# Altium schematic sheet LED_Readout.SchDoc
size C
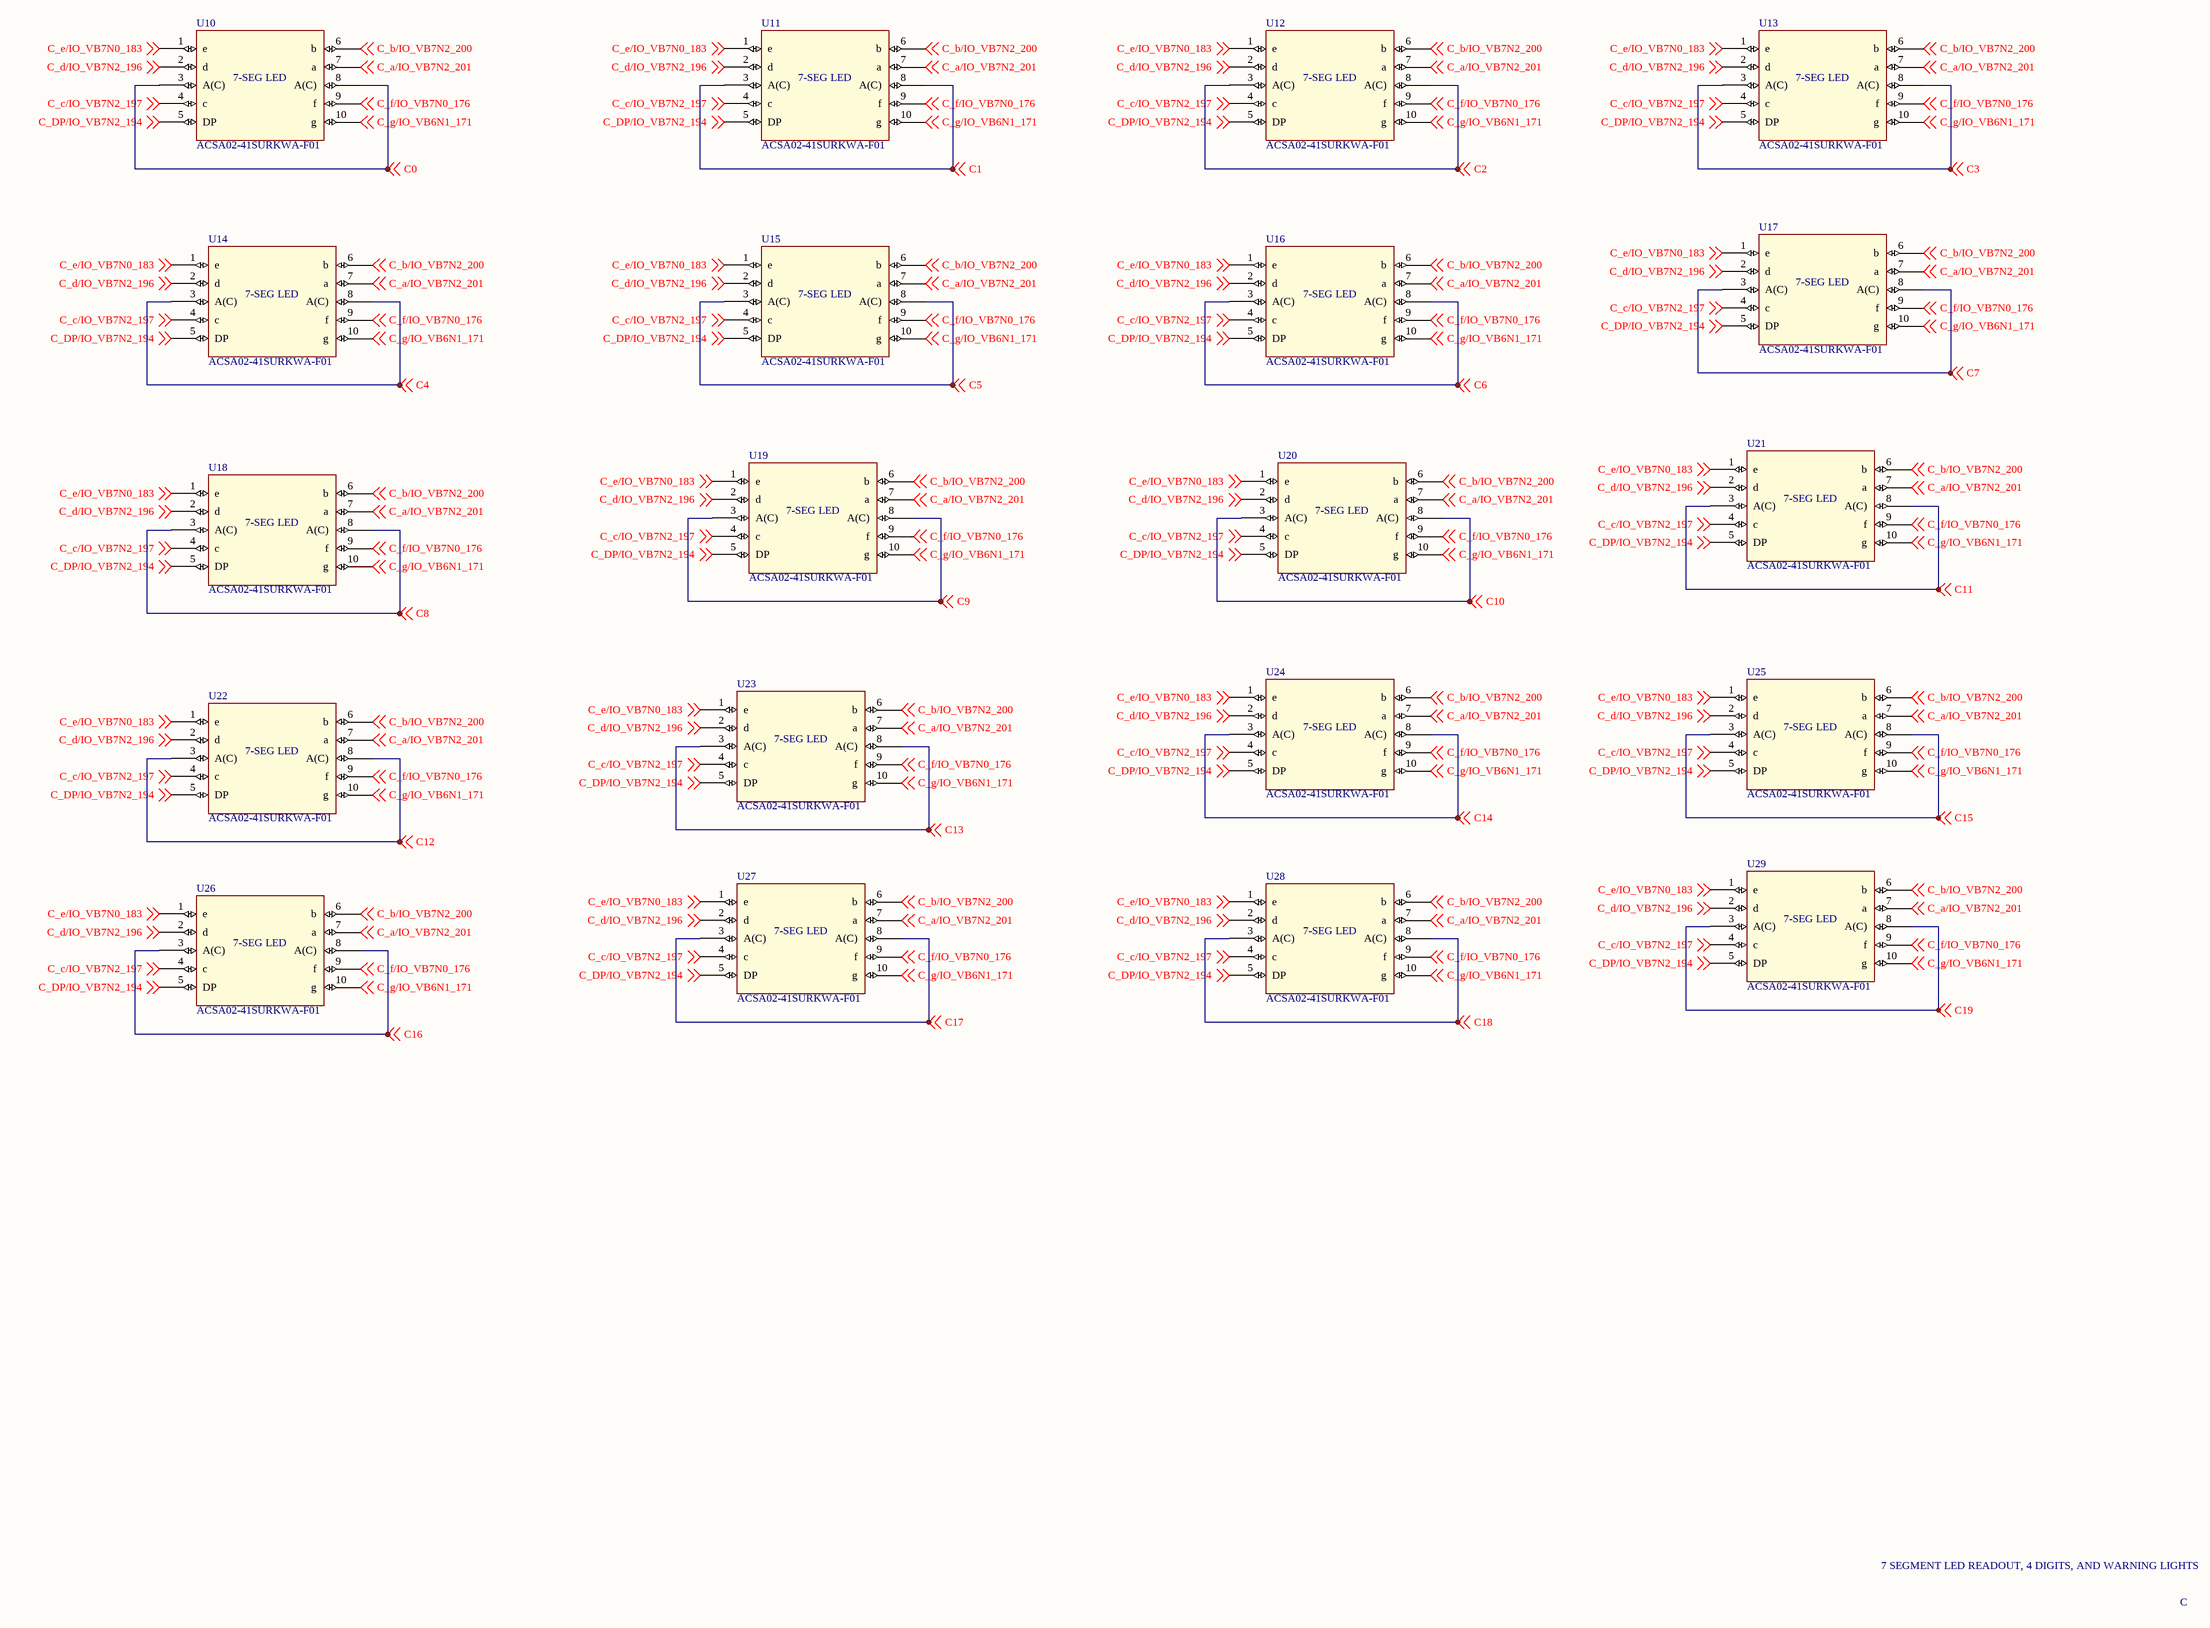
[diagram p0: LED_Readout.SchDoc]

## Parts
U10  ACSA02-41SURKWA-F01  [ACSA02-41SURKWA-F01]
U11  ACSA02-41SURKWA-F01  [ACSA02-41SURKWA-F01]
U12  ACSA02-41SURKWA-F01  [ACSA02-41SURKWA-F01]
U13  ACSA02-41SURKWA-F01  [ACSA02-41SURKWA-F01]
U14  ACSA02-41SURKWA-F01  [ACSA02-41SURKWA-F01]
U15  ACSA02-41SURKWA-F01  [ACSA02-41SURKWA-F01]
U16  ACSA02-41SURKWA-F01  [ACSA02-41SURKWA-F01]
U17  ACSA02-41SURKWA-F01  [ACSA02-41SURKWA-F01]
U18  ACSA02-41SURKWA-F01  [ACSA02-41SURKWA-F01]
U19  ACSA02-41SURKWA-F01  [ACSA02-41SURKWA-F01]
U20  ACSA02-41SURKWA-F01  [ACSA02-41SURKWA-F01]
U21  ACSA02-41SURKWA-F01  [ACSA02-41SURKWA-F01]
U22  ACSA02-41SURKWA-F01  [ACSA02-41SURKWA-F01]
U23  ACSA02-41SURKWA-F01  [ACSA02-41SURKWA-F01]
U24  ACSA02-41SURKWA-F01  [ACSA02-41SURKWA-F01]
U25  ACSA02-41SURKWA-F01  [ACSA02-41SURKWA-F01]
U26  ACSA02-41SURKWA-F01  [ACSA02-41SURKWA-F01]
U27  ACSA02-41SURKWA-F01  [ACSA02-41SURKWA-F01]
U28  ACSA02-41SURKWA-F01  [ACSA02-41SURKWA-F01]
U29  ACSA02-41SURKWA-F01  [ACSA02-41SURKWA-F01]

## Nets
C0: U10.3(A(C)) U10.8(A(C)) ; off-sheet C0
C1: U11.3(A(C)) U11.8(A(C)) ; off-sheet C1
C2: U12.3(A(C)) U12.8(A(C)) ; off-sheet C2
C3: U13.3(A(C)) U13.8(A(C)) ; off-sheet C3
C4: U14.3(A(C)) U14.8(A(C)) ; off-sheet C4
C5: U15.3(A(C)) U15.8(A(C)) ; off-sheet C5
C6: U16.3(A(C)) U16.8(A(C)) ; off-sheet C6
C7: U17.3(A(C)) U17.8(A(C)) ; off-sheet C7
C8: U18.3(A(C)) U18.8(A(C)) ; off-sheet C8
C9: U19.3(A(C)) U19.8(A(C)) ; off-sheet C9
C10: U20.3(A(C)) U20.8(A(C)) ; off-sheet C10
C11: U21.3(A(C)) U21.8(A(C)) ; off-sheet C11
C12: U22.3(A(C)) U22.8(A(C)) ; off-sheet C12
C13: U23.3(A(C)) U23.8(A(C)) ; off-sheet C13
C14: U24.3(A(C)) U24.8(A(C)) ; off-sheet C14
C15: U25.3(A(C)) U25.8(A(C)) ; off-sheet C15
C16: U26.3(A(C)) U26.8(A(C)) ; off-sheet C16
C17: U27.3(A(C)) U27.8(A(C)) ; off-sheet C17
C18: U28.3(A(C)) U28.8(A(C)) ; off-sheet C18
C19: U29.3(A(C)) U29.8(A(C)) ; off-sheet C19
C_a/IO_VB7N2_201: U10.7(a) U11.7(a) U12.7(a) U13.7(a) U14.7(a) U15.7(a) U16.7(a) U17.7(a) U18.7(a) U19.7(a) U20.7(a) U21.7(a) U22.7(a) U23.7(a) U24.7(a) U25.7(a) U26.7(a) U27.7(a) U28.7(a) U29.7(a) ; off-sheet C_a/IO_VB7N2_201
C_b/IO_VB7N2_200: U10.6(b) U11.6(b) U12.6(b) U13.6(b) U14.6(b) U15.6(b) U16.6(b) U17.6(b) U18.6(b) U19.6(b) U20.6(b) U21.6(b) U22.6(b) U23.6(b) U24.6(b) U25.6(b) U26.6(b) U27.6(b) U28.6(b) U29.6(b) ; off-sheet C_b/IO_VB7N2_200
C_c/IO_VB7N2_197: U10.4(c) U11.4(c) U12.4(c) U13.4(c) U14.4(c) U15.4(c) U16.4(c) U17.4(c) U18.4(c) U19.4(c) U20.4(c) U21.4(c) U22.4(c) U23.4(c) U24.4(c) U25.4(c) U26.4(c) U27.4(c) U28.4(c) U29.4(c) ; off-sheet C_c/IO_VB7N2_197
C_d/IO_VB7N2_196: U10.2(d) U11.2(d) U12.2(d) U13.2(d) U14.2(d) U15.2(d) U16.2(d) U17.2(d) U18.2(d) U19.2(d) U20.2(d) U21.2(d) U22.2(d) U23.2(d) U24.2(d) U25.2(d) U26.2(d) U27.2(d) U28.2(d) U29.2(d) ; off-sheet C_d/IO_VB7N2_196
C_DP/IO_VB7N2_194: U10.5(DP) U11.5(DP) U12.5(DP) U13.5(DP) U14.5(DP) U15.5(DP) U16.5(DP) U17.5(DP) U18.5(DP) U19.5(DP) U20.5(DP) U21.5(DP) U22.5(DP) U23.5(DP) U24.5(DP) U25.5(DP) U26.5(DP) U27.5(DP) U28.5(DP) U29.5(DP) ; off-sheet C_DP/IO_VB7N2_194
C_e/IO_VB7N0_183: U10.1(e) U11.1(e) U12.1(e) U13.1(e) U14.1(e) U15.1(e) U16.1(e) U17.1(e) U18.1(e) U19.1(e) U20.1(e) U21.1(e) U22.1(e) U23.1(e) U24.1(e) U25.1(e) U26.1(e) U27.1(e) U28.1(e) U29.1(e) ; off-sheet C_e/IO_VB7N0_183
C_f/IO_VB7N0_176: U10.9(f) U11.9(f) U12.9(f) U13.9(f) U14.9(f) U15.9(f) U16.9(f) U17.9(f) U18.9(f) U19.9(f) U20.9(f) U21.9(f) U22.9(f) U23.9(f) U24.9(f) U25.9(f) U26.9(f) U27.9(f) U28.9(f) U29.9(f) ; off-sheet C_f/IO_VB7N0_176
C_g/IO_VB6N1_171: U10.10(g) U11.10(g) U12.10(g) U13.10(g) U14.10(g) U15.10(g) U16.10(g) U17.10(g) U18.10(g) U19.10(g) U20.10(g) U21.10(g) U22.10(g) U23.10(g) U24.10(g) U25.10(g) U26.10(g) U27.10(g) U28.10(g) U29.10(g) ; off-sheet C_g/IO_VB6N1_171

## Notes on the sheet
- 7 SEGMENT LED READOUT, 4 DIGITS, AND WARNING LIGHTS
- C
- (in symbol ACSA02-41SURKWA-F01) 7-SEG LED

## Library data of the parts
U10-U29 = ACSA02-41SURKWA-F01: Surface Mount Display; Supplier 1: Digi-Key